# Altium schematic sheet NB-Fi-Router.SchDoc: Роутер NB-Fi
size 420 x 297 mm; CompanyName: Телематические решения; Address1: Address1; Address2: Address2; Address3: Address3; Address4: Address4; DocumentNumber: XXXX.012345.007Э3; SheetNumber: 1; SheetTotal: 1; Scale: 1:1; Title2str: Плата ESP32-NB-Fi; DocumentType: Схема электрическая принципиальная; FirstReferrence: АБВГ.123456.001
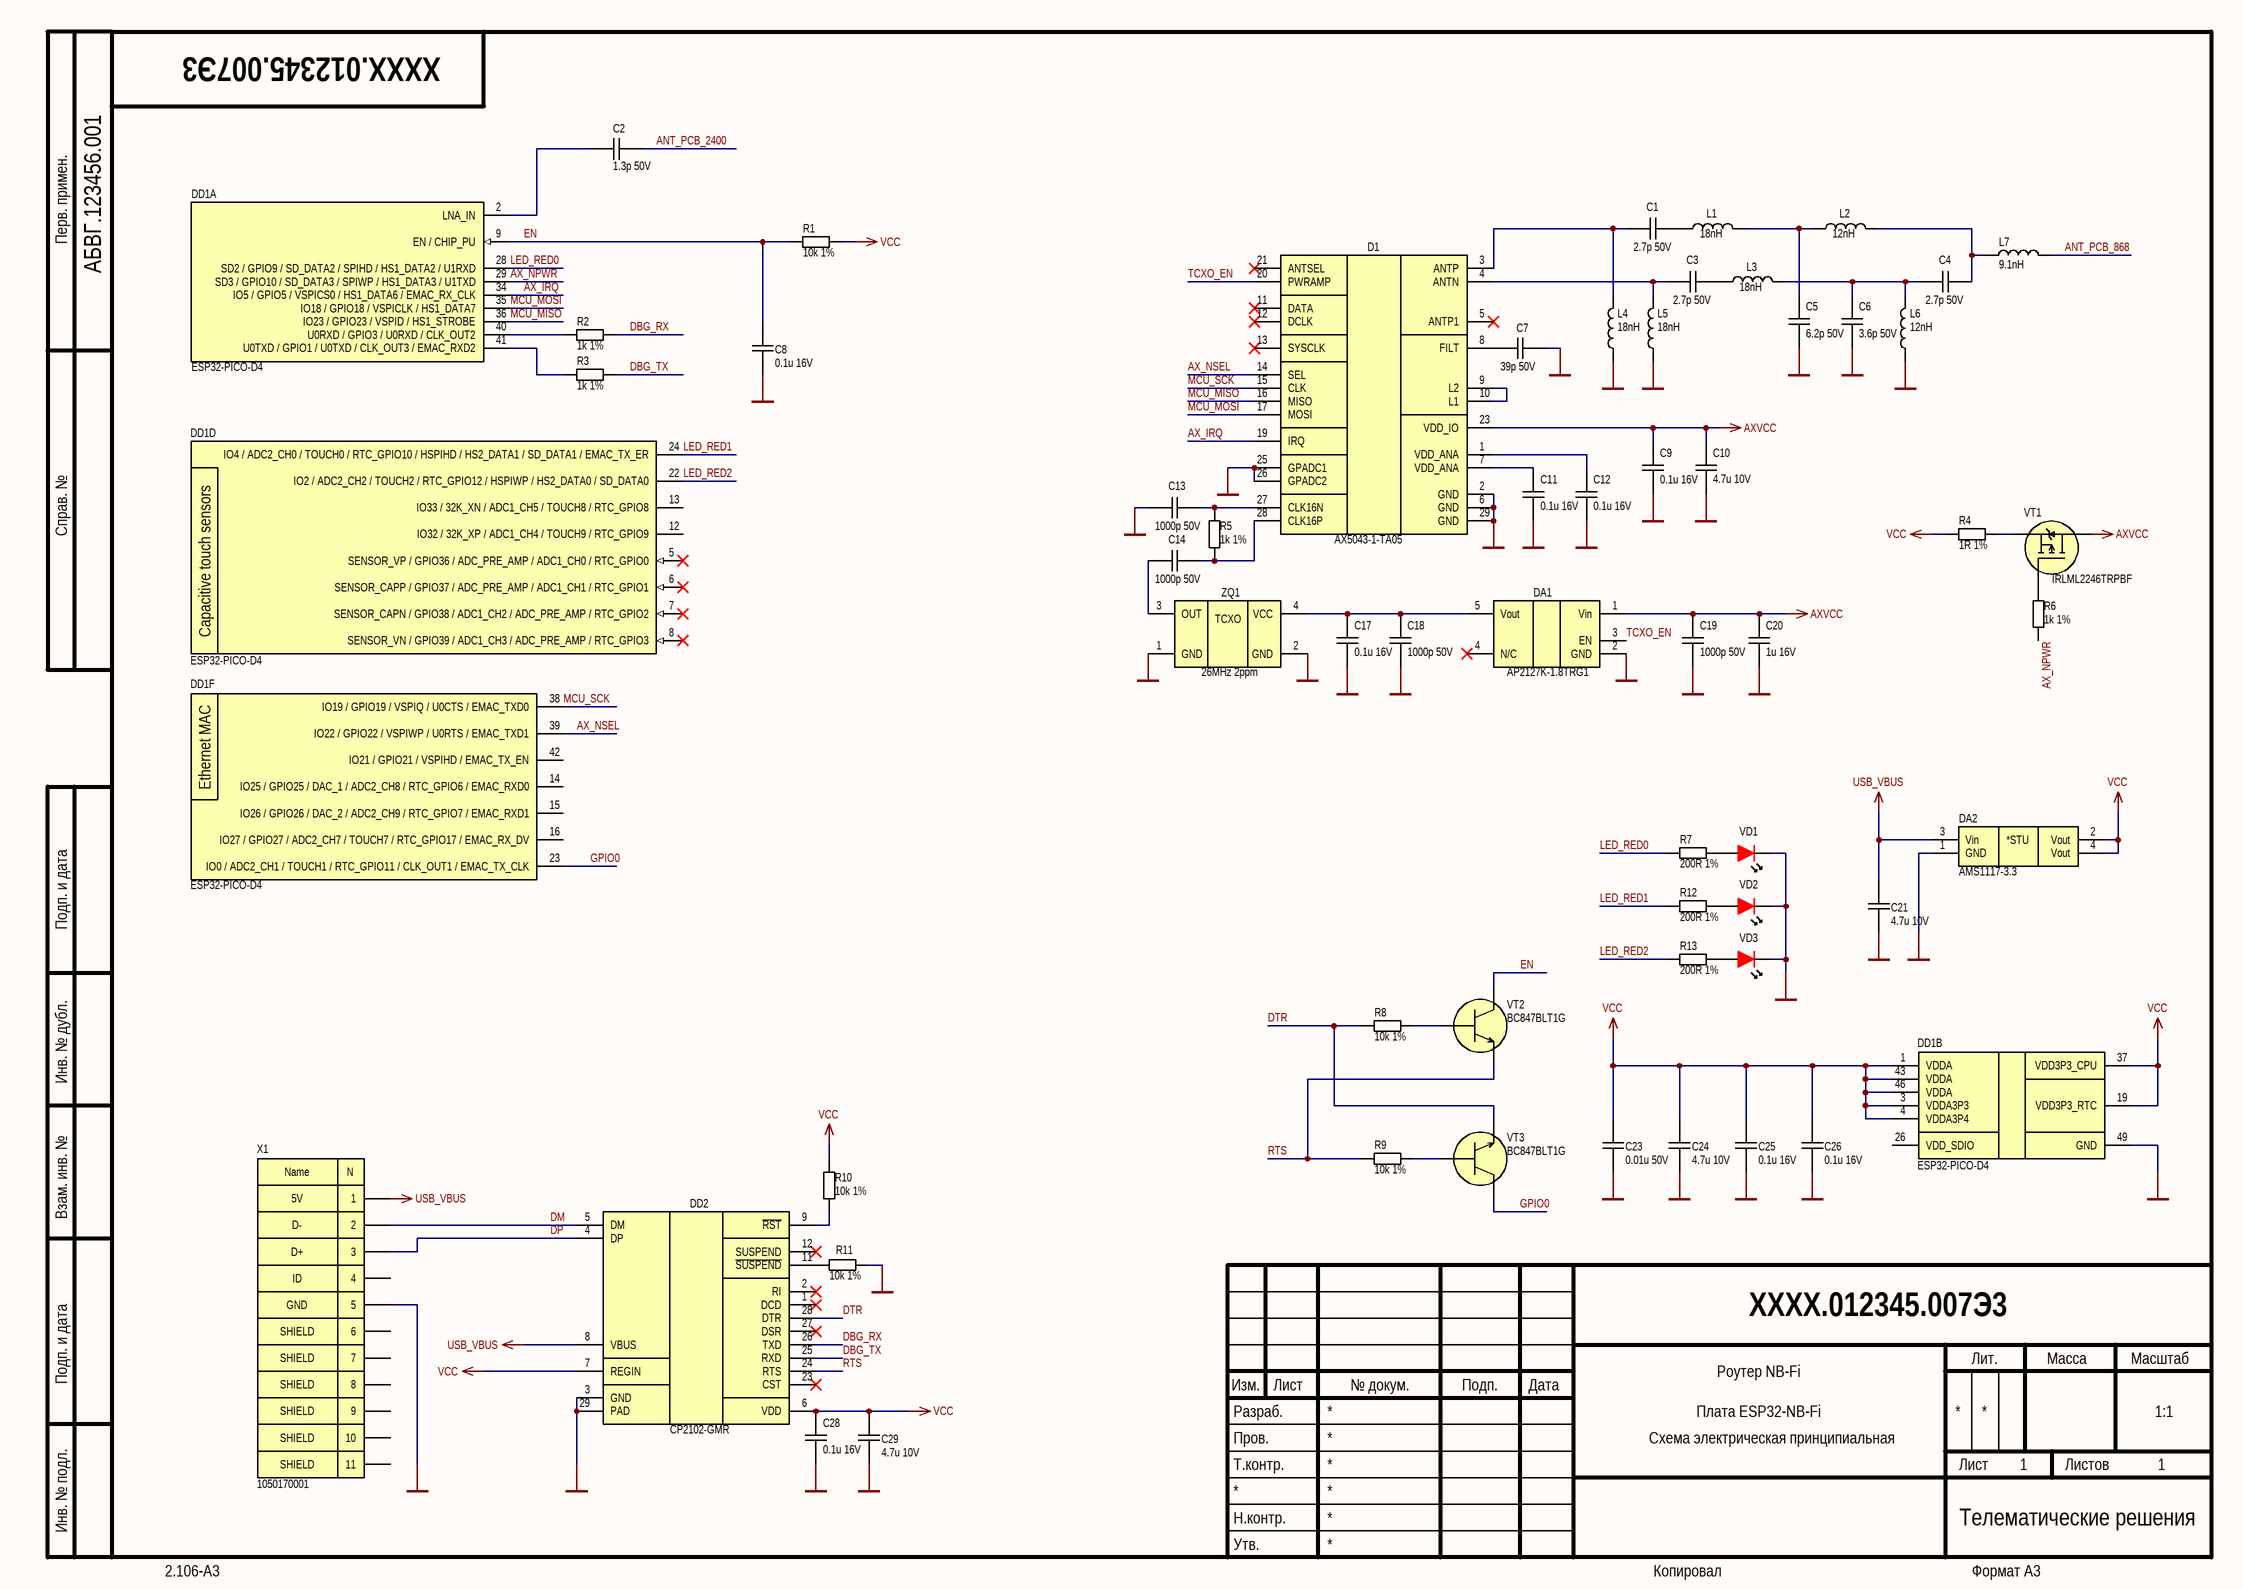
[diagram p0: NB-Fi-Router.SchDoc]

## Parts
C1  2.7p 50V  [C0603]
C2  1.3p 50V  [C0603]
C3  2.7p 50V  [C0603]
C4  2.7p 50V  [C0603]
C5  6.2p 50V  [C0603]
C6  3.6p 50V  [C0603]
C7  39p 50V  [C0603]
C8  0.1u 16V  [C0603]
C9  0.1u 16V  [C0603]
C10  4.7u 10V  [C0603]
C11  0.1u 16V  [C0603]
C12  0.1u 16V  [C0603]
C13  1000p 50V  [C0603]
C14  1000p 50V  [C0603]
C17  0.1u 16V  [C0603]
C18  1000p 50V  [C0603]
C19  1000p 50V  [C0603]
C20  1u 16V  [C0603]
C21  4.7u 10V  [C0603]
C23  0.01u 50V  [C0603]
C24  4.7u 10V  [C0603]
C25  0.1u 16V  [C0603]
C26  0.1u 16V  [C0603]
C28  0.1u 16V  [C0603]
C29  4.7u 10V  [C0603]
D1  AX5043-1-TA05  [QFN28]
DA1  AP2127K-1.8TRG1  [SOT23-5]
DA2  AMS1117-3.3  [SOT223-4]
DD1  ESP32-PICO-D4  [QFN48-7x7]  (parts A,B,D,F of 7)
DD2  CP2102-GMR  [QFN28]
L1  18nH  [L0603_LQW]
L2  12nH  [L0603_LQW]
L3  18nH  [L0603_LQW]
L4  18nH  [L0603_LQW]
L5  18nH  [L0603_LQW]
L6  12nH  [L0603_LQW]
L7  9.1nH  [L0603_LQW]
R1  10k 1%  [R0603]
R2  1k 1%  [R0603]
R3  1k 1%  [R0603]
R4  1R 1%  [R0603]
R5  1k 1%  [R0603]
R6  1k 1%  [R0603]
R7  200R 1%  [R0603]
R8  10k 1%  [R0603]
R9  10k 1%  [R0603]
R10  10k 1%  [R0603]
R11  10k 1%  [R0603]
R12  200R 1%  [R0603]
R13  200R 1%  [R0603]
VD1  RED  [LED0603_RED]  (value not drawn)
VD2  RED  [LED0603_RED]  (value not drawn)
VD3  RED  [LED0603_RED]  (value not drawn)
VT1  IRLML2246TRPBF  [SOT23-3L]
VT2  BC847BLT1G  [SOT23-3L]
VT3  BC847BLT1G  [SOT23-3L]
X1  1050170001  [1050170001]
ZQ1  26MHz 2ppm  [QSMD2.0x1.6x0.7]

## Nets
AXVCC: C9.2 C10.2 C19.1 C20.2 D1.23(VDD_IO) DA1.1(Vin) VT1.3(D)
GND: C5.1 C6.1 C7.2 C8.1 C9.1 C10.1 C11.1 C12.1 C13.2 C17.1 C18.2 C19.2 C20.1 C21.1 C23.1 C24.1 C25.1 C26.1 C28.1 C29.1 D1.2(GND) D1.6(GND) D1.25(GPADC1) D1.26(GPADC2) D1.29(GND) DA1.2(GND) DA2.1(GND) DD1.49(GND) DD2.3(GND) DD2.29(PAD) L4.1 L5.1 L6.1 R11.1 VD1.2 VD2.2 VD3.2 X1.5 ZQ1.1(GND) ZQ1.2(GND)
USB_VBUS: C21.2 DA2.3(Vin) DD2.8(VBUS) X1.1
VCC: C23.2 C24.2 C25.2 C26.2 C28.2 C29.2 DA2.2(Vout) DA2.4(Vout) DD1.1(VDDA) DD1.3(VDDA3P3) DD1.4(VDDA3P4) DD1.19(VDD3P3_RTC) DD1.37(VDD3P3_CPU) DD1.43(VDDA) DD1.46(VDDA) DD2.6(VDD) DD2.7(REGIN) R1.2 R4.1 R10.2
ANT_PCB_868: L7.2
ANT_PCB_2400: C2.2
AX_IRQ: D1.19(IRQ) DD1.34(IO5_/_GPIO5_/_VSPICS0_/_HS1_DATA6_/_EMAC_RX_CLK)
AX_NPWR: DD1.29(SD3_/_GPIO10_/_SD_DATA3_/_SPIWP_/_HS1_DATA3_/_U1TXD) R6.1
AX_NSEL: D1.14(SEL) DD1.39(IO22_/_GPIO22_/_VSPIWP_/_U0RTS_/_EMAC_TXD1)
DBG_RX: DD2.26(TXD) R2.2
DBG_TX: DD2.25(RXD) R3.2
DM: DD2.5(DM) X1.2
DP: DD2.4(DP) X1.3
DTR: DD2.28(DTR) R8.1 VT3.2(E)
EN: C8.2 DD1.9(EN_/_CHIP_PU) R1.1 VT2.3(C)
GPIO0: DD1.23(IO0_/_ADC2_CH1_/_TOUCH1_/_RTC_GPIO11_/_CLK_OUT1_/_EMAC_TX_CLK) VT3.3(C)
LED_RED0: DD1.28(SD2_/_GPIO9_/_SD_DATA2_/_SPIHD_/_HS1_DATA2_/_U1RXD) R7.1
LED_RED1: DD1.24(IO4_/_ADC2_CH0_/_TOUCH0_/_RTC_GPIO10_/_HSPIHD_/_HS2_DATA1_/_SD_DATA1_/_EMAC_TX_ER) R12.1
LED_RED2: DD1.22(IO2_/_ADC2_CH2_/_TOUCH2_/_RTC_GPIO12_/_HSPIWP_/_HS2_DATA0_/_SD_DATA0) R13.1
MCU_MISO: D1.16(MISO) DD1.36(IO23_/_GPIO23_/_VSPID_/_HS1_STROBE)
MCU_MOSI: D1.17(MOSI) DD1.35(IO18_/_GPIO18_/_VSPICLK_/_HS1_DATA7)
MCU_SCK: D1.15(CLK) DD1.38(IO19_/_GPIO19_/_VSPIQ_/_U0CTS_/_EMAC_TXD0)
RTS: DD2.24(RTS) R9.1 VT2.2(E)
TCXO_EN: D1.20(PWRAMP) DA1.3(EN)
NetC1_1: C1.1 D1.3(ANTP) L4.2
NetC1_2: C1.2 L1.1
NetC2_1: C2.1 DD1.2(LNA_IN)
NetC3_1: C3.1 D1.4(ANTN) L5.2
NetC3_2: C3.2 L3.1
NetC4_1: C4.1 C6.2 L3.2 L6.2
NetC4_2: C4.2 L2.2 L7.1
NetC5_2: C5.2 L1.2 L2.1
NetC7_1: C7.1 D1.8(FILT)
NetC11_2: C11.2 D1.7(VDD_ANA)
NetC12_2: C12.2 D1.1(VDD_ANA)
NetC13_1: C13.1 D1.27(CLK16N) R5.2
NetC14_1: C14.1 D1.28(CLK16P) R5.1
NetC14_2: C14.2 ZQ1.3(OUT)
NetC17_2: C17.2 C18.1 DA1.5(Vout) ZQ1.4(VCC)
NetD1_9: D1.9(L2) D1.10(L1)
NetDD1_40: DD1.40(U0RXD_/_GPIO3_/_U0RXD_/_CLK_OUT2) R2.1
NetDD1_41: DD1.41(U0TXD_/_GPIO1_/_U0TXD_/_CLK_OUT3_/_EMAC_RXD2) R3.1
NetDD2_9: DD2.9(~{RST}) R10.1
NetDD2_11: DD2.11(~{SUSPEND}) R11.2
NetR4_2: R4.2 VT1.2(S)
NetR6_2: R6.2 VT1.1(G)
NetR7_2: R7.2 VD1.1
NetR8_2: R8.2 VT2.1(B)
NetR9_2: R9.2 VT3.1(B)
NetR12_2: R12.2 VD2.1
NetR13_2: R13.2 VD3.1

Not connected (* = marked no-connect by the designer): D1 5(ANTP1)* 11(DATA)* 12(DCLK)* 13(SYSCLK)* 21(ANTSEL)*; DA1 4(N/C)*; DD1 5(SENSOR_VP_/_GPIO36_/_ADC_PRE_AMP_/_ADC1_CH0_/_RTC_GPIO0)* 6(SENSOR_CAPP_/_GPIO37_/_ADC_PRE_AMP_/_ADC1_CH1_/_RTC_GPIO1)* 7(SENSOR_CAPN_/_GPIO38_/_ADC1_CH2_/_ADC_PRE_AMP_/_RTC_GPIO2)* 8(SENSOR_VN_/_GPIO39_/_ADC1_CH3_/_ADC_PRE_AMP_/_RTC_GPIO3)* 12(IO32_/_32K_XP_/_ADC1_CH4_/_TOUCH9_/_RTC_GPIO9) 13(IO33_/_32K_XN_/_ADC1_CH5_/_TOUCH8_/_RTC_GPIO8) 14(IO25_/_GPIO25_/_DAC_1_/_ADC2_CH8_/_RTC_GPIO6_/_EMAC_RXD0) 15(IO26_/_GPIO26_/_DAC_2_/_ADC2_CH9_/_RTC_GPIO7_/_EMAC_RXD1) 16(IO27_/_GPIO27_/_ADC2_CH7_/_TOUCH7_/_RTC_GPIO17_/_EMAC_RX_DV) 26(VDD_SDIO) 42(IO21_/_GPIO21_/_VSPIHD_/_EMAC_TX_EN); DD2 1(DCD)* 2(RI)* 12(SUSPEND)* 23(CST)* 27(DSR)*; X1 4 6 7 8 9 10 11

## Notes on the sheet
- Перв. примен.
- Справ. №
- Подп. и дата
- Инв. № дубл.
- Взам. инв. №
- Разраб.
- Изм.
- Лист
- № докум.
- Подп.
- Дата
- Лит.
- Масса
- Масштаб
- Пров.
- Т.контр.
- Листов
- Инв. № подл.
- Утв.
- Н.контр.
- 2.106-A3
- Копировал
- Формат А3
- (in symbol 1050170001) Name; N; 5V; D-; D+; ID; GND; SHIELD
- (in symbol AMS1117-3.3) *STU
- (in symbol ESP32-PICO-D4, part D) Capacitive touch sensors
- (in symbol ESP32-PICO-D4, part F) Ethernet MAC
- (in symbol NT2016SA-26.000000MHZ-NBG2) TCXO

## Library data of the parts
C1 C3 C4 = CC0603BRNPO9BN2R7: CERCAP 2.7p/50V 0603 BNPO; PartNumber: CC0603BRNPO9BN2R7
C2 = CC0603BRNPO9BN1R3: CAP CER 1.3PF 50V NPO 0603; PartNumber: CC0603BRNPO9BN1R3
C5 = CC0603BRNPO9BN6R2: CERCAP 6.2p/50V 0603 BNPO; PartNumber: CC0603BRNPO9BN6R2
C6 = CC0603BRNPO9BN3R6: CERCAP 3.6p/50V 0603 BNPO; PartNumber: CC0603BRNPO9BN3R6
C7 = CC0603JRNPO9BN390: CERCAP 39p/50V 0603 JNPO; PartNumber: CC0603JRNPO9BN390
C8 C9 C11 C12 C17 C25 C26 C28 = CC0603KRX7R7BB104: CERCAP 0.1/16V 0603 KX7R; PartNumber: CC0603KRX7R7BB104
C10 C24 = C: CERCAP 4.7/10V 0603 KX5R; PartNumber: CC0603KRX5R6BB475
C13 C14 C18 C19 = CC0603JRNPO9BN102: CERCAP 1000p/50V 0603 JNPO; PartNumber: CC0603JRNPO9BN102
C20 = CC0603KRX7R7BB105: CERCAP 1/16V 0603 KX7R; PartNumber: CC0603KRX7R7BB105
C21 C29 = CC0603KRX5R6BB475: CERCAP 4.7/10V 0603 KX5R; PartNumber: CC0603KRX5R6BB475
C23 = CC0603KRX7R9BB103: CAP CER 10000PF 50V X7R 0603; PartNumber: CC0603KRX7R9BB103
D1 = AX5043-1-TA05: RF Transceiver RADIO TRANSCEIVER; PartNumber: AX5043-1-TA05
DA1 = AP2127K-1.8TRG1: LDO Voltage Regulators 1.8V 80mA CMOS LDO w/Enable; PartNumber: AP2127K-1.8TRG1
DA2 = AMS1117-3.3: 1A LOW DROPOUT VOLTAGE REGULATOR; PartNumber: AMS1117-3.3; ComponentLink1Description: Datasheet; ComponentLink1URL: https://static.chipdip.ru/lib/552/DOC001552809.pdf
DD1 = ESP32-PICO-D4: The ESP32-PICO-D4 is a System-in-Package (SIP) module that is based on ESP32, providing complete Wi-Fi / and Bluetooth functionalities. The module has a size as small as 7.0±0.1 mm×7.0±0.1 mm×0.94±0.1 mm, thus requiring minimal PCB area. The module integrates a 4-MB SPI flash.; PartNumber: ESP32-PICO-D4
DD2 = CP2102-GMR: IC USB-TO-UART BRIDGE 28VQFN; PartNumber: CP2102-GMR
L1 L3-L5 = LQW18AN18NG00D: Fixed Inductors 0603 18nH 2%; PartNumber: LQW18AN18NG00D
L2 L6 = LQW18AN12NJ00D: Fixed Inductors 12 NH 5% (R); PartNumber: LQW18AN12NJ00D
L7 = LQW18AN9N1D00D: 9.1nH Unshielded Wirewound Inductor 650mA 110mOhm Max 0603 (1608 Metric); PartNumber: LQW18AN9N1D00D
R1 R8-R11 = RC0603FR-0710KL: RES 0603 10K 1%; PartNumber: RC0603FR-0710KL
R2 R3 R5 R6 = RC0603FR-071KL: RES 0603 1K 1%; PartNumber: RC0603FR-071KL
R4 = R: RES 0603 1R 1%; PartNumber: RC0603FR-071RL
R7 R12 R13 = RC0603FR-07200RL: RES 0603 200R 1%; PartNumber: RC0603FR-07200RL
VD1-VD3 = FYLS-0603URC: LED Red 0603; PartNumber: FYLS-0603URC
VT1 = IRLML2246TRPBF: MOSFET MOSFT PCh -20V -2.6A 135mOhm -2.5V cpbl; PartNumber: IRLML2246TRPBF
VT2 VT3 = BC847BLT1G: Bipolar (BJT) Transistor NPN 45V 100mA 100MHz 300mW Surface Mount SOT-23-3 (TO-236); PartNumber: BC847BLT1G
X1 = 1050170001: USB - micro B USB 2.0 Receptacle Connector 5 Position Surface Mount, Right Angle; Through Hole; PartNumber: 1050170001
ZQ1 = NT2016SA-26.000000MHZ-NBG2: TCXO Oscillator 4-pin; PartNumber: NT2016SA-26.000000MHZ-NBG2